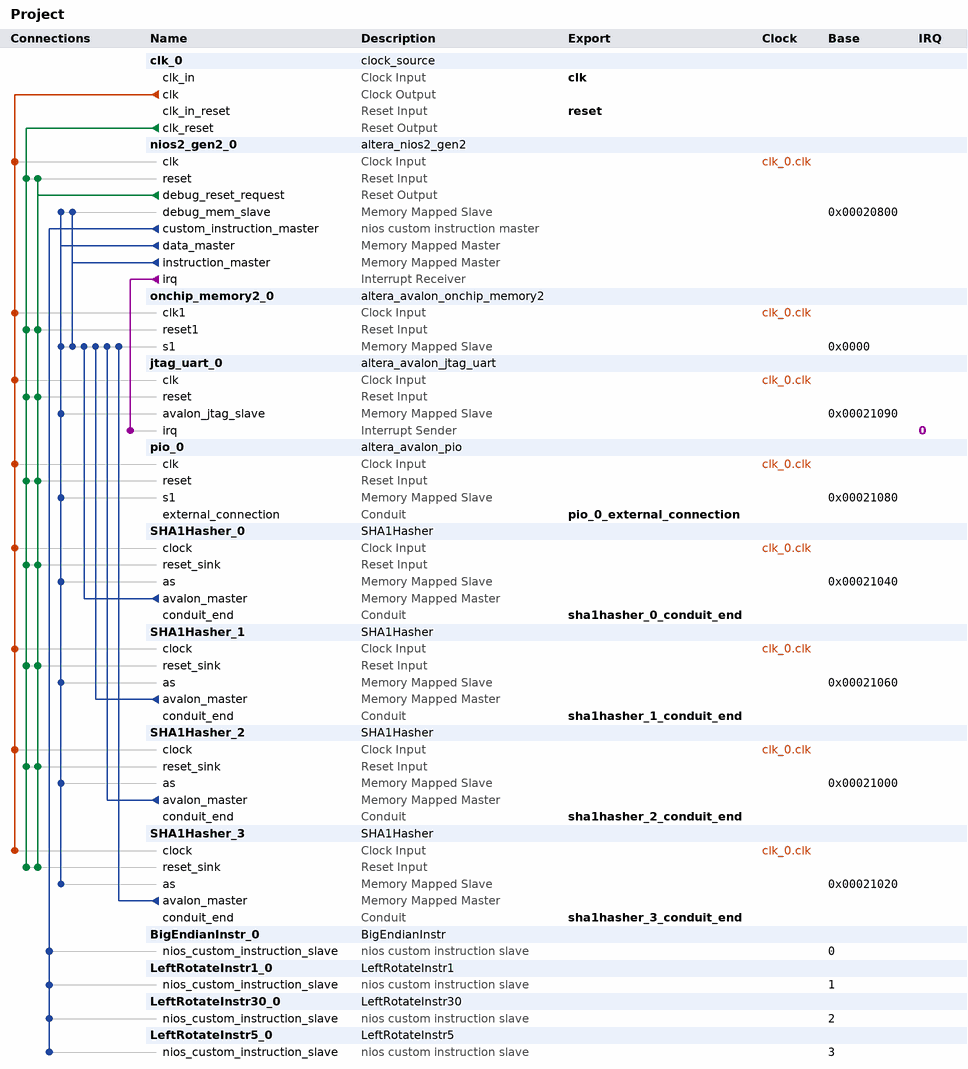
[diagram p0: system contents]
# Platform Designer (Qsys) system Project, Cyclone V 5CSEMA5F31C6
# Parameters at their usual value, and those the tool derives, are not listed.
package require -exact qsys 18.1
create_system Project
set_project_property DEVICE_FAMILY {Cyclone V}
set_project_property DEVICE 5CSEMA5F31C6

add_instance clk_0 clock_source 18.1
set_instance_parameter_value clk_0 clockFrequency 50000000

add_instance nios2_gen2_0 altera_nios2_gen2 18.1
set_instance_parameter_value nios2_gen2_0 dcache_size 2048
set_instance_parameter_value nios2_gen2_0 exceptionSlave onchip_memory2_0.s1
set_instance_parameter_value nios2_gen2_0 icache_size 4096
set_instance_parameter_value nios2_gen2_0 impl Fast
set_instance_parameter_value nios2_gen2_0 resetSlave onchip_memory2_0.s1

add_instance onchip_memory2_0 altera_avalon_onchip_memory2 18.1
set_instance_parameter_value onchip_memory2_0 dataWidth 32
set_instance_parameter_value onchip_memory2_0 dualPort false
set_instance_parameter_value onchip_memory2_0 initMemContent true
set_instance_parameter_value onchip_memory2_0 initializationFileName onchip_mem.hex
set_instance_parameter_value onchip_memory2_0 memorySize 131072

add_instance jtag_uart_0 altera_avalon_jtag_uart 18.1
set_instance_parameter_value jtag_uart_0 simInteractiveOptions NO_INTERACTIVE_WINDOWS

add_instance pio_0 altera_avalon_pio 18.1
set_instance_parameter_value pio_0 direction Output
set_instance_parameter_value pio_0 width 8

add_instance SHA1Hasher_0 SHA1Hasher 1.0

add_instance SHA1Hasher_1 SHA1Hasher 1.0

add_instance SHA1Hasher_2 SHA1Hasher 1.0

add_instance SHA1Hasher_3 SHA1Hasher 1.0

add_instance BigEndianInstr_0 BigEndianInstr 1.0

add_instance LeftRotateInstr1_0 LeftRotateInstr1 1.0

add_instance LeftRotateInstr30_0 LeftRotateInstr30 1.0

add_instance LeftRotateInstr5_0 LeftRotateInstr5 1.0

# connections
add_connection clk_0.clk jtag_uart_0.clk clock
add_connection clk_0.clk nios2_gen2_0.clk clock
add_connection clk_0.clk onchip_memory2_0.clk1 clock
add_connection clk_0.clk pio_0.clk clock
add_connection clk_0.clk SHA1Hasher_0.clock clock
add_connection clk_0.clk SHA1Hasher_1.clock clock
add_connection clk_0.clk SHA1Hasher_2.clock clock
add_connection clk_0.clk SHA1Hasher_3.clock clock
add_connection clk_0.clk_reset jtag_uart_0.reset reset
add_connection clk_0.clk_reset nios2_gen2_0.reset reset
add_connection clk_0.clk_reset onchip_memory2_0.reset1 reset
add_connection clk_0.clk_reset pio_0.reset reset
add_connection clk_0.clk_reset SHA1Hasher_0.reset_sink reset
add_connection clk_0.clk_reset SHA1Hasher_1.reset_sink reset
add_connection clk_0.clk_reset SHA1Hasher_2.reset_sink reset
add_connection clk_0.clk_reset SHA1Hasher_3.reset_sink reset
add_connection nios2_gen2_0.debug_reset_request jtag_uart_0.reset reset
add_connection nios2_gen2_0.debug_reset_request nios2_gen2_0.reset reset
add_connection nios2_gen2_0.debug_reset_request onchip_memory2_0.reset1 reset
add_connection nios2_gen2_0.debug_reset_request pio_0.reset reset
add_connection nios2_gen2_0.debug_reset_request SHA1Hasher_0.reset_sink reset
add_connection nios2_gen2_0.debug_reset_request SHA1Hasher_1.reset_sink reset
add_connection nios2_gen2_0.debug_reset_request SHA1Hasher_2.reset_sink reset
add_connection nios2_gen2_0.debug_reset_request SHA1Hasher_3.reset_sink reset
add_connection nios2_gen2_0.data_master jtag_uart_0.avalon_jtag_slave avalon
set_connection_parameter_value nios2_gen2_0.data_master/jtag_uart_0.avalon_jtag_slave baseAddress 0x00021090
add_connection nios2_gen2_0.data_master nios2_gen2_0.debug_mem_slave avalon
set_connection_parameter_value nios2_gen2_0.data_master/nios2_gen2_0.debug_mem_slave baseAddress 0x00020800
add_connection nios2_gen2_0.data_master onchip_memory2_0.s1 avalon
set_connection_parameter_value nios2_gen2_0.data_master/onchip_memory2_0.s1 baseAddress 0x0000
add_connection nios2_gen2_0.data_master pio_0.s1 avalon
set_connection_parameter_value nios2_gen2_0.data_master/pio_0.s1 baseAddress 0x00021080
add_connection nios2_gen2_0.data_master SHA1Hasher_0.as avalon
set_connection_parameter_value nios2_gen2_0.data_master/SHA1Hasher_0.as baseAddress 0x00021040
add_connection nios2_gen2_0.data_master SHA1Hasher_1.as avalon
set_connection_parameter_value nios2_gen2_0.data_master/SHA1Hasher_1.as baseAddress 0x00021060
add_connection nios2_gen2_0.data_master SHA1Hasher_2.as avalon
set_connection_parameter_value nios2_gen2_0.data_master/SHA1Hasher_2.as baseAddress 0x00021000
add_connection nios2_gen2_0.data_master SHA1Hasher_3.as avalon
set_connection_parameter_value nios2_gen2_0.data_master/SHA1Hasher_3.as baseAddress 0x00021020
add_connection nios2_gen2_0.instruction_master nios2_gen2_0.debug_mem_slave avalon
set_connection_parameter_value nios2_gen2_0.instruction_master/nios2_gen2_0.debug_mem_slave baseAddress 0x00020800
add_connection nios2_gen2_0.instruction_master onchip_memory2_0.s1 avalon
set_connection_parameter_value nios2_gen2_0.instruction_master/onchip_memory2_0.s1 baseAddress 0x0000
add_connection SHA1Hasher_0.avalon_master onchip_memory2_0.s1 avalon
set_connection_parameter_value SHA1Hasher_0.avalon_master/onchip_memory2_0.s1 baseAddress 0x0000
add_connection SHA1Hasher_1.avalon_master onchip_memory2_0.s1 avalon
set_connection_parameter_value SHA1Hasher_1.avalon_master/onchip_memory2_0.s1 baseAddress 0x0000
add_connection SHA1Hasher_2.avalon_master onchip_memory2_0.s1 avalon
set_connection_parameter_value SHA1Hasher_2.avalon_master/onchip_memory2_0.s1 baseAddress 0x0000
add_connection SHA1Hasher_3.avalon_master onchip_memory2_0.s1 avalon
set_connection_parameter_value SHA1Hasher_3.avalon_master/onchip_memory2_0.s1 baseAddress 0x0000
add_connection nios2_gen2_0.irq jtag_uart_0.irq interrupt
set_connection_parameter_value nios2_gen2_0.irq/jtag_uart_0.irq irqNumber 0
add_connection nios2_gen2_0.custom_instruction_master BigEndianInstr_0.nios_custom_instruction_slave nios_custom_instruction
set_connection_parameter_value nios2_gen2_0.custom_instruction_master/BigEndianInstr_0.nios_custom_instruction_slave CIName bigendianinstr_0
set_connection_parameter_value nios2_gen2_0.custom_instruction_master/BigEndianInstr_0.nios_custom_instruction_slave baseAddress 0
add_connection nios2_gen2_0.custom_instruction_master LeftRotateInstr1_0.nios_custom_instruction_slave nios_custom_instruction
set_connection_parameter_value nios2_gen2_0.custom_instruction_master/LeftRotateInstr1_0.nios_custom_instruction_slave CIName leftrotateinstr1_0
set_connection_parameter_value nios2_gen2_0.custom_instruction_master/LeftRotateInstr1_0.nios_custom_instruction_slave baseAddress 1
add_connection nios2_gen2_0.custom_instruction_master LeftRotateInstr5_0.nios_custom_instruction_slave nios_custom_instruction
set_connection_parameter_value nios2_gen2_0.custom_instruction_master/LeftRotateInstr5_0.nios_custom_instruction_slave CIName leftrotateinstr5_0
set_connection_parameter_value nios2_gen2_0.custom_instruction_master/LeftRotateInstr5_0.nios_custom_instruction_slave baseAddress 3
add_connection nios2_gen2_0.custom_instruction_master LeftRotateInstr30_0.nios_custom_instruction_slave nios_custom_instruction
set_connection_parameter_value nios2_gen2_0.custom_instruction_master/LeftRotateInstr30_0.nios_custom_instruction_slave CIName leftrotateinstr30_0
set_connection_parameter_value nios2_gen2_0.custom_instruction_master/LeftRotateInstr30_0.nios_custom_instruction_slave baseAddress 2

# exported interfaces
add_interface clk clock sink
set_interface_property clk EXPORT_OF clk_0.clk_in
add_interface pio_0_external_connection conduit end
set_interface_property pio_0_external_connection EXPORT_OF pio_0.external_connection
add_interface reset reset sink
set_interface_property reset EXPORT_OF clk_0.clk_in_reset
add_interface sha1hasher_0_conduit_end conduit end
set_interface_property sha1hasher_0_conduit_end EXPORT_OF SHA1Hasher_0.conduit_end
add_interface sha1hasher_1_conduit_end conduit end
set_interface_property sha1hasher_1_conduit_end EXPORT_OF SHA1Hasher_1.conduit_end
add_interface sha1hasher_2_conduit_end conduit end
set_interface_property sha1hasher_2_conduit_end EXPORT_OF SHA1Hasher_2.conduit_end
add_interface sha1hasher_3_conduit_end conduit end
set_interface_property sha1hasher_3_conduit_end EXPORT_OF SHA1Hasher_3.conduit_end

set_interconnect_requirement {$system} qsys_mm.clockCrossingAdapter HANDSHAKE
set_interconnect_requirement {$system} qsys_mm.enableEccProtection FALSE
set_interconnect_requirement {$system} qsys_mm.insertDefaultSlave FALSE
set_interconnect_requirement {$system} qsys_mm.maxAdditionalLatency 1

save_system Project.qsys
